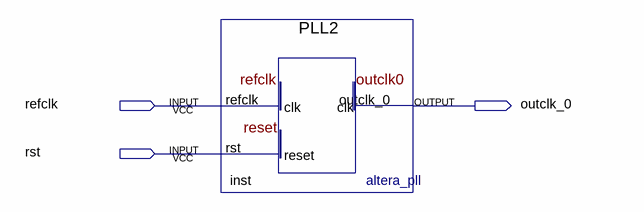
[diagram p0: schematic sheet]
// Quartus schematic PLL2_Block.bdf as structural Verilog: 1 symbols, 3 pins
module PLL2_Block (
  input  refclk,
  input  rst,
  output outclk_0
);

  PLL2 inst (.refclk(refclk), .rst(rst), .outclk_0(outclk_0));
endmodule
